# EAGLE design Sensor room (EAGLE 8.6.0)
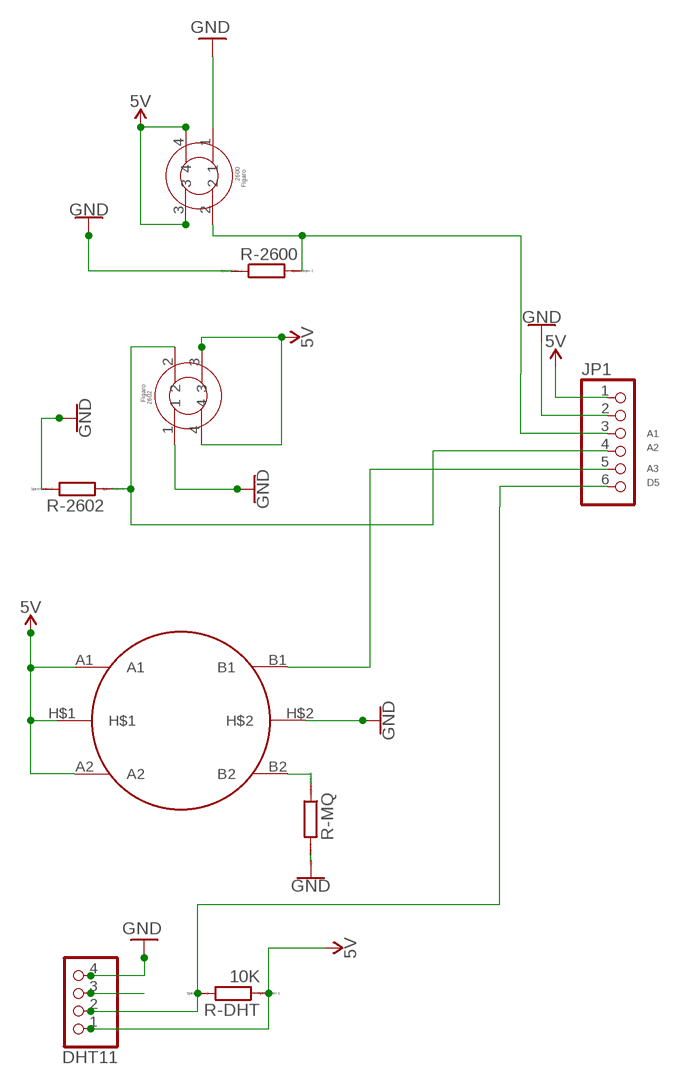
[diagram p0: schematic, sheet 1]

## Parts
2600  FIGARO2602  [FIGARO2602]
2602  FIGARO2602  [FIGARO2602]
DHT11  PINHD-1X4  [1X04]
JP1  PINHD-1X6CB  [1X06-CLEANBIG]
MQ-135  MQ_135_A  [MQ-135]
R-2600  R0207/10  [0207/10]
R-2602  R0207/10  [0207/10]
R-DHT  10K  R0207/10  [0207/10]
R-MQ  R0207/10  [0207/10]

## Nets
5V [supply]: 2600.3 2600.4 2602.3 2602.4 DHT11.1 JP1.1 MQ-135.A1 MQ-135.A2 MQ-135.H$1 R-DHT.1
GND: 2600.1 2602.1 DHT11.4 JP1.2 MQ-135.H$2 R-2600.1 R-2602.2 R-MQ.2
N$1: DHT11.2 JP1.6 R-DHT.2
N$2: JP1.5 MQ-135.B1
N$3: MQ-135.B2 R-MQ.1
N$5: 2602.2 JP1.4 R-2602.1
N$13: DHT11.3
N$16: 2600.2 JP1.3 R-2600.2

## Notes on the sheet
- A1
- A2
- A3
- D5

## Library data of the parts
2600 2602 = Figaro2602:FIGARO2602
DHT11 = pinhead:PINHD-1X4: PIN HEADER
JP1 = adafruit:PINHD-1X6: PIN HEADER
MQ-135 = MQ_135_A:MQ_135_A
R-2600 R-2602 R-DHT R-MQ = eagle-ltspice:R: RESISTOR, European symbol; SPICEMODEL: NONE; SPICEPREFIX: R

## Net classes
0 default: width 0.457 mm, clearance 0.432 mm
1 supply: width 0.584 mm, clearance 0.508 mm

## Board
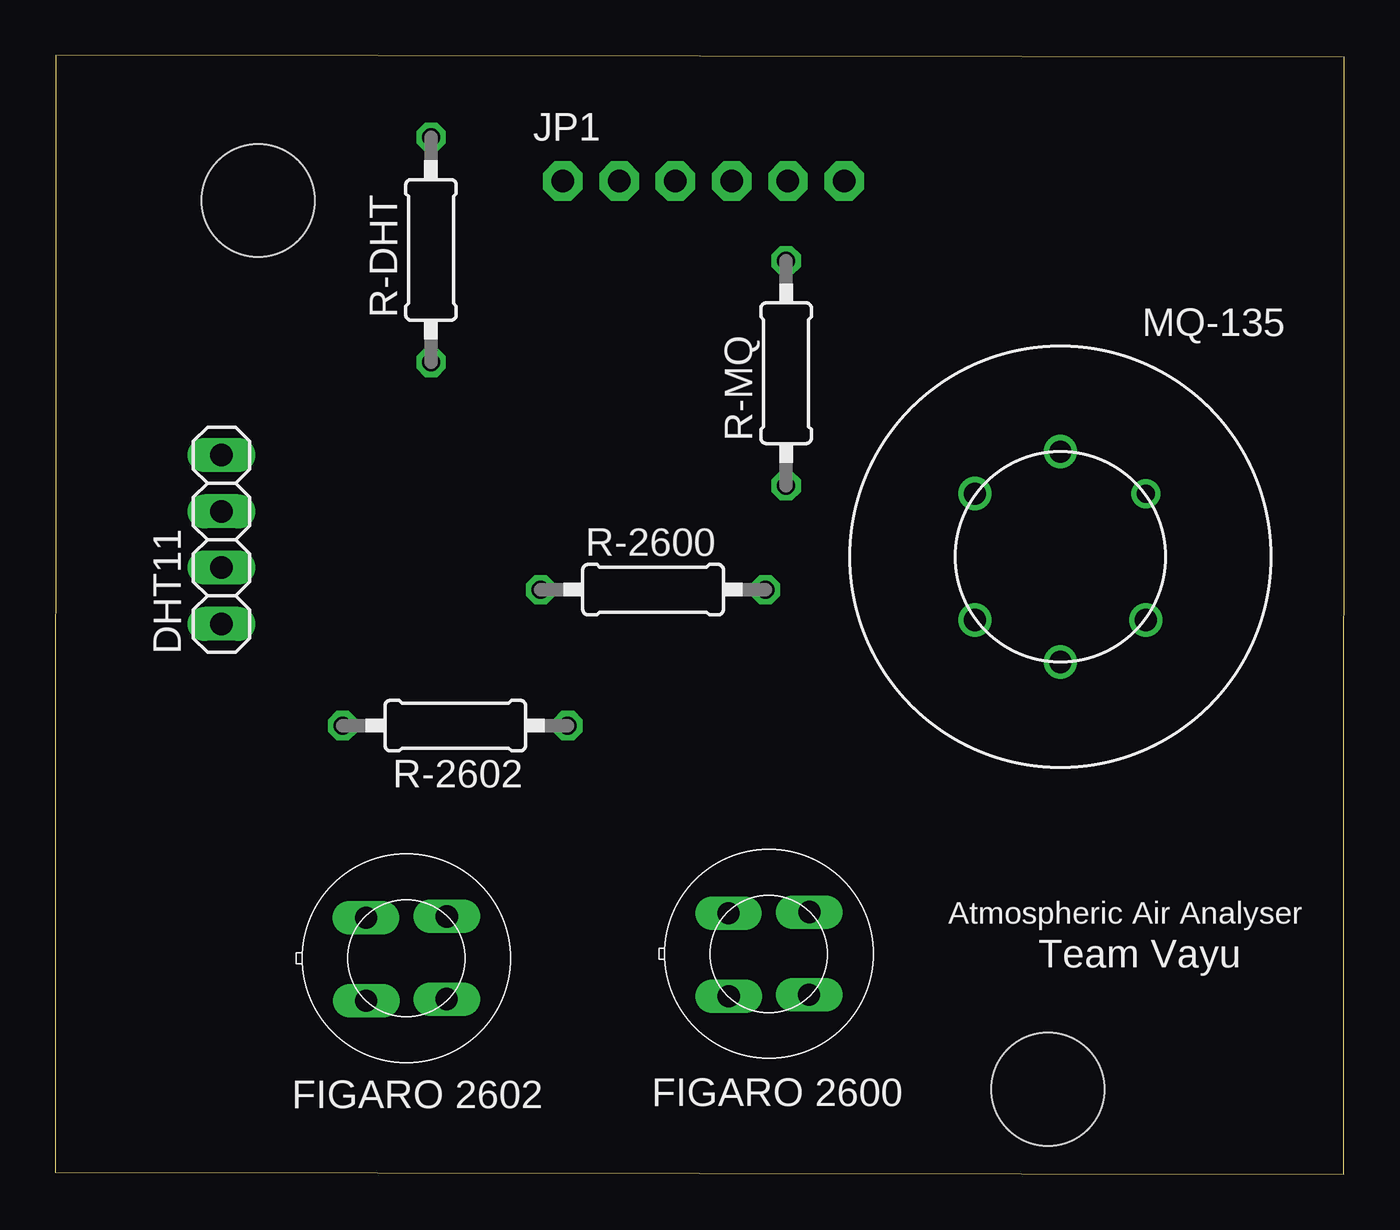
[diagram p1: board, top side]
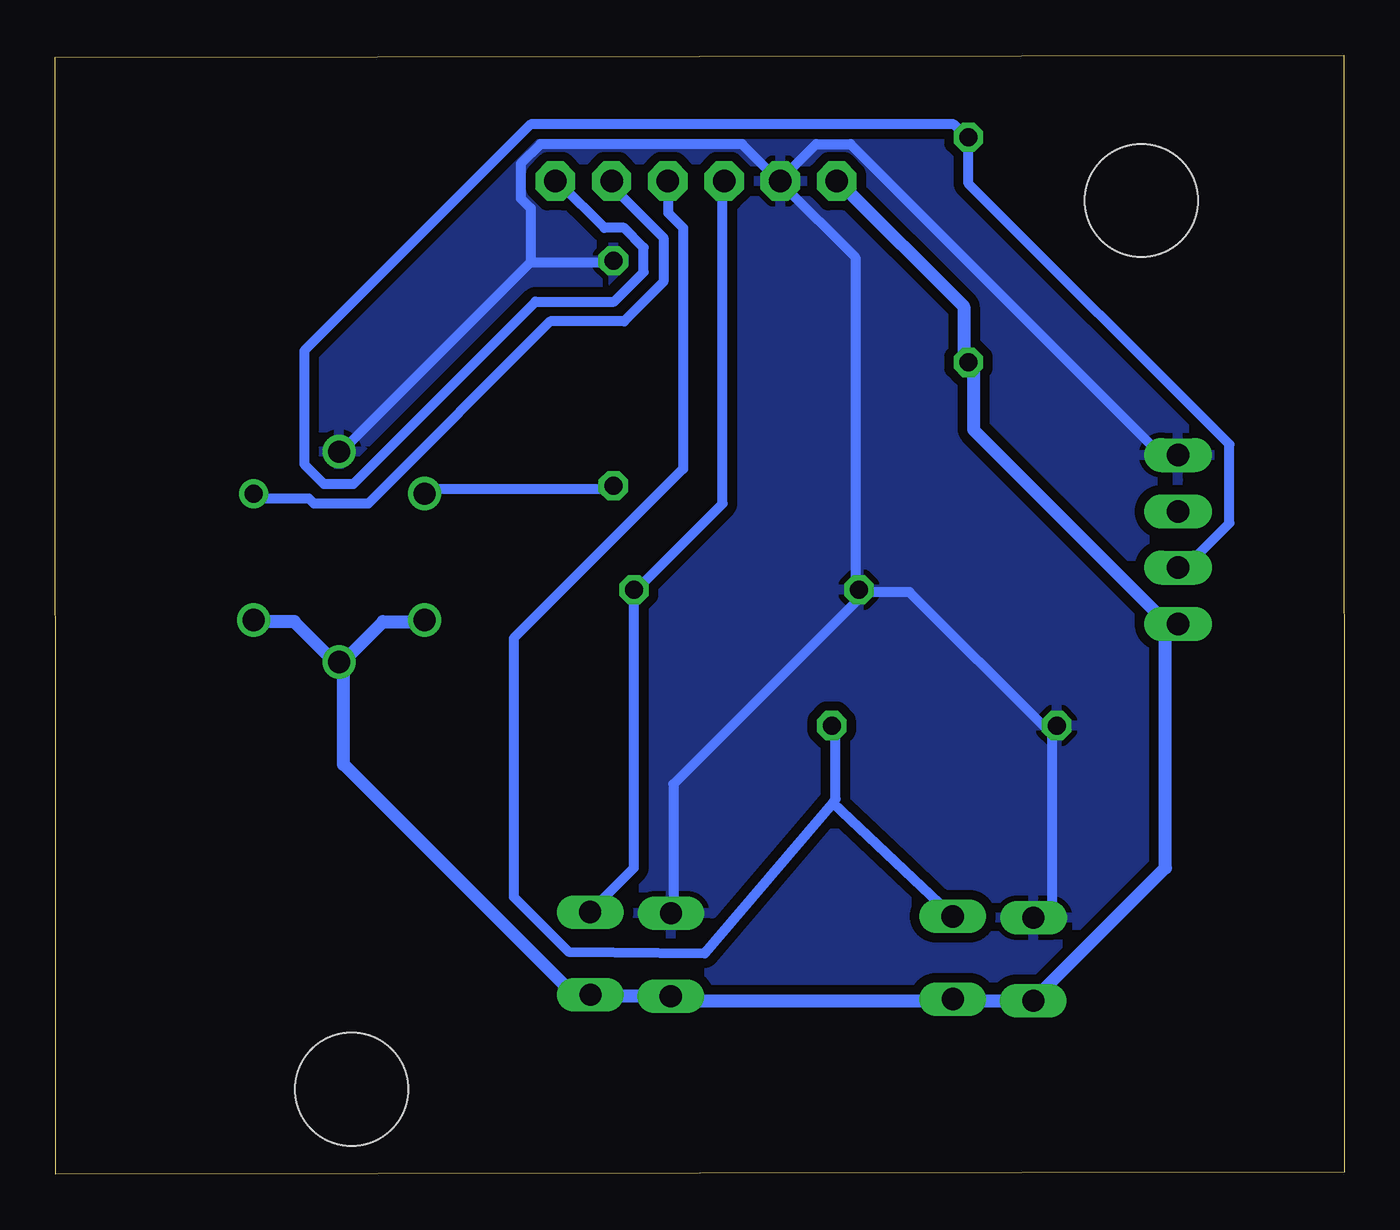
[diagram p2: board, bottom side, seen from below]

Size 58.2 x 50.51 mm. Coordinates in mm from the lower left corner, seen from the top.
Outline: 0,0.08 58.18,0 58.2,50.43 0.02,50.51 0,0.08
Copper layers (1*16): Top 0.035mm / dielectric 1.5mm / Bottom 0.035mm
Design rules "default": minimum track width 6mil, minimum drill 0.35mm, track to track 6mil, track to pad 6mil, pad to pad 6mil, via to via 6mil, smd to smd 6mil, copper to edge 40mil, drill to drill 6mil, minimum pad ring 10mil, minimum via ring 8mil, stop-mask expansion 4mil, vias tented up to drill 0mil, thermal gap 10mil
Holes 5.08 mm at 9.16,43.95 44.82,3.83

### Footprints (pad centres in the part's own frame; a part is rotated, then mirrored left to right if it is on the bottom)
FIGARO2602 = drill 1 long: 1 -1.82,1.83; 2 1.83,1.89; 3 1.82,-1.84; 4 -1.81,-1.91
1X04 = drill 1.016 long: 1 -3.81,0; 2 -1.27,0; 3 1.27,0; 4 3.81,0
1X06-CLEANBIG = drill 1.016 pad 1.778 octagon: 1 -6.35,0; 2 -3.81,0; 3 -1.27,0; 4 1.27,0; 5 3.81,0; 6 6.35,0
MQ-135 = drill 1: A1 -3.86,2.85; A2 3.86,2.85; B2 3.86,-2.85; H$1 0,4.75; H$2 0,-4.75 | drill 0.8: B1 -3.86,-2.85
0207/10 = drill 0.813 octagon: 1 -5.08,0; 2 5.08,0

### Placement (x,y rotation side)
2600  32.22,9.94 0 top
2602  15.85,9.74 0 top
DHT11  7.5,28.65 90 top
JP1  29.27,44.83 0 top
MQ-135  45.38,27.87 180 top
R-2600  26.99,26.39 0 top
R-2602  18.06,20.25 180 top
R-DHT  16.96,41.72 90 top
R-MQ  33,36.16 90 top

### Tracks (layer width: path | path; a pad name or v marks a point on that pad's centre or on a via)
5V
  Bottom 0.584: JP1.1 22.74,44.72 17.18,39.17 17.18,36.72 R-DHT.1 16.74,36.5 16.74,33.61 8.07,24.94 7.63,24.94 DHT11.1 8.07,24.72 8.07,13.83 13.85,8.05 2602.4 14.07,7.83 17.63,7.83 2602.3 17.85,7.83 30.3,7.83 2600.4 30.52,8.05 33.85,8.05 2600.3 34.3,8.05 34.74,8.05 45.19,18.5 45.19,22.94 MQ-135.H$1 | MQ-135.A2 41.63,24.94 43.41,24.94 45.19,23.16 MQ-135.H$1 | MQ-135.A1 49.19,24.94 47.41,24.94 45.63,23.16 MQ-135.H$1
GND
  Bottom 0.457: 2602.1 13.85,11.61 13.18,12.27 13.18,20.05 R-2602.2 13.4,20.05 19.63,26.27 21.85,26.27 R-2600.1 | 2600.1 30.3,11.83 30.3,17.61 21.85,26.05 R-2600.1 | 36.74,41.17 33.18,41.17 R-MQ.2 | 36.74,41.17 45.19,32.72 MQ-135.H$2 | DHT11.4 7.63,32.5 8.29,32.5 22.29,46.5 23.85,46.5 25.41,44.94 JP1.2 | 36.74,41.17 36.74,43.61 37.18,44.05 37.18,45.61 36.3,46.5 27.18,46.5 25.63,44.94 JP1.2 | R-2600.1 22.07,26.5 22.07,41.39 25.41,44.72 JP1.2
  pour Bottom: 3.21,48.58 56.93,48.58 56.93,1.33 3.21,1.33
N$1
  Bottom 0.457: DHT11.2 7.4,27.16 5.18,29.39 5.18,32.94 16.96,44.72 16.96,46.72 R-DHT.2 17.18,46.94 17.63,47.39 36.74,47.39 46.96,37.16 46.96,32.05 46.07,31.16 44.74,31.16 36.52,39.39 32.96,39.39 31.63,40.72 31.63,41.83 32.52,42.72 33.41,42.72 35.41,44.72 JP1.6
N$2
  Bottom 0.457: MQ-135.B1 49.19,30.5 46.74,30.5 46.52,30.28 44.07,30.28 35.85,38.5 32.52,38.5 30.74,40.28 30.74,42.28 33.18,44.72 JP1.5
N$3
  Bottom 0.457: R-MQ.1 33.18,30.94 41.19,30.94 41.41,30.72 MQ-135.B2
N$5
  Bottom 0.457: 23.08,16.76 17.85,11.83 2602.2 | 23.08,16.76 22.96,16.94 22.96,20.05 R-2602.1 | 35.03,10.04 28.89,9.97 23.08,16.76 | JP1.4 30.52,44.72 30.52,43.39 29.85,42.72 29.85,31.84 37.5,24.19 37.5,12.52 35.03,10.04 | 35.03,10.05 35.03,10.04
N$16
  Bottom 0.457: 2600.2 33.85,12.05 32.07,13.83 32.07,26.27 R-2600.2 31.85,26.5 28.07,30.28 28.07,44.72 JP1.3

### Text on the board
tNames: MQ-135 | Atmospheric Air Analyser | Team Vayu | FIGARO 2602 | FIGARO 2600